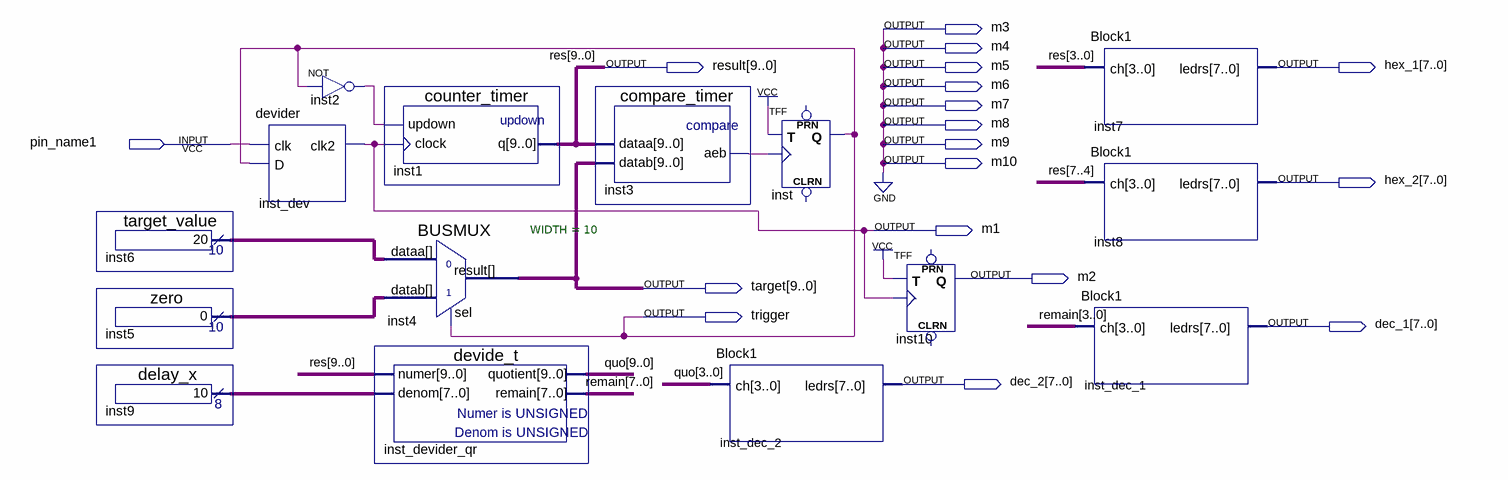
[diagram p0: schematic sheet]
// Quartus schematic lab8.bdf as structural Verilog: 15 symbols, 18 pins
module lab8 (
  input  pin_name1,
  output m3,
  output m4,
  output [9:0] result,
  output m5,
  output [7:0] hex_1,
  output m6,
  output m7,
  output m8,
  output m9,
  output m10,
  output [7:0] hex_2,
  output m1,
  output m2,
  output [9:0] target,
  output trigger,
  output [7:0] dec_1,
  output [7:0] dec_2
);

  wire inst2_out, inst3_aeb;
  wire [7:0] inst9_result, remain;
  wire [9:0] inst5_result, inst6_result, quo;

  target_value inst6 (.result(inst6_result));
  zero inst5 (.result(inst5_result));
  delay_x inst9 (.result(inst9_result));
  devider inst_dev (.clk(pin_name1), .D(trigger), .clk2(m1));
  not inst2 (inst2_out, trigger);
  counter_timer inst1 (.updown(inst2_out), .clock(m1), .q(result));
  BUSMUX #(.WIDTH(10)) inst4 (.datab(inst5_result), .sel(trigger), .dataa(inst6_result), .result(target));
  devide_t inst_devider_qr (.numer(result), .denom(inst9_result), .quotient(quo), .remain(remain));
  compare_timer inst3 (.dataa(result), .datab(target), .aeb(inst3_aeb));
  Block1 inst_dec_2 (.ch(quo[3:0]), .ledrs(dec_2));
  TFF inst (.T(1'b1), .CLK(inst3_aeb), .Q(trigger));  // open: PRN, CLRN
  TFF inst10 (.T(1'b1), .CLK(m1), .Q(m2));  // open: PRN, CLRN
  Block1 inst7 (.ch(result[3:0]), .ledrs(hex_1));
  Block1 inst8 (.ch(result[7:4]), .ledrs(hex_2));
  Block1 inst_dec_1 (.ch(remain[3:0]), .ledrs(dec_1));

  assign m3 = 1'b0;
  assign m4 = 1'b0;
  assign m5 = 1'b0;
  assign m6 = 1'b0;
  assign m7 = 1'b0;
  assign m8 = 1'b0;
  assign m9 = 1'b0;
  assign m10 = 1'b0;

  // Other names for the same wires on the sheet: res[9:0] = result
endmodule
